# Altium schematic sheet LDO.SchDoc
size A; SheetNumber: 2; SheetTotal: 6
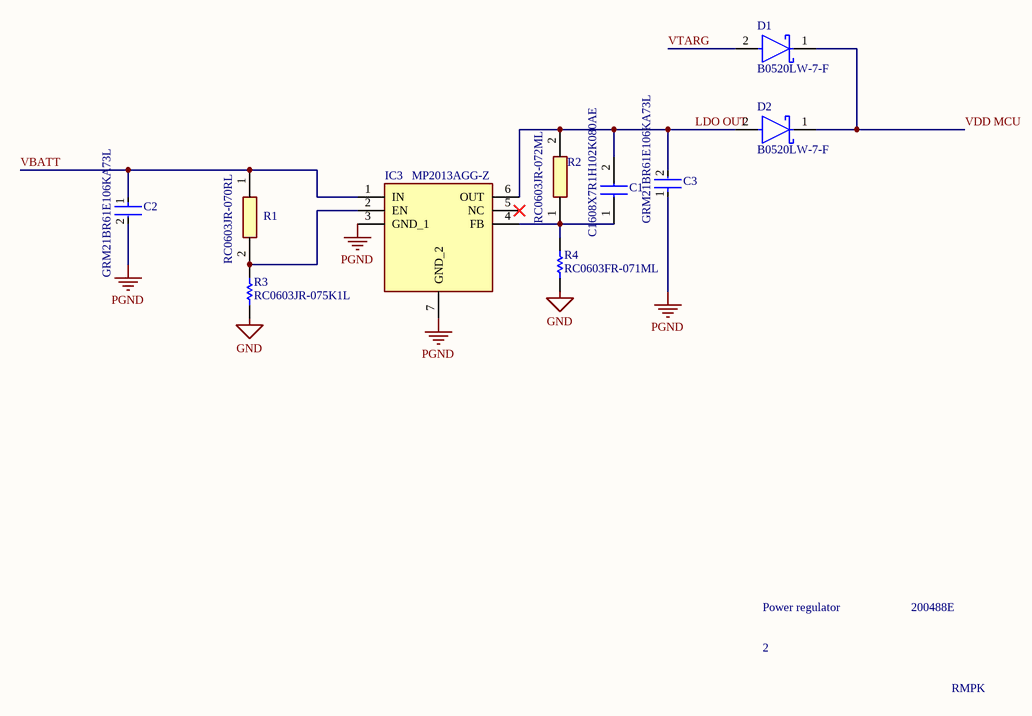
[diagram p0: LDO.SchDoc]

## Parts
C1  C1608X7R1H102K080AE  [CAPC1608X80N]
C2  GRM21BR61E106KA73L  [FP-GRM21B-0_15-IPC_C]
C3  GRM21BR61E106KA73L  [FP-GRM21B-0_15-IPC_C]
D1  B0520LW-7-F  [FP-SOD123-MFG]
D2  B0520LW-7-F  [FP-SOD123-MFG]
IC3  MP2013AGG-Z  [SON65P200X200X100-7N-D]
R1  RC0603JR-070RL  [RESC1608X55N]
R2  RC0603JR-072ML  [RESC1608X55N]
R3  RC0603JR-075K1L  [RESC1608X55X25LL10T15]
R4  RC0603FR-071ML  [RESC1608X55X25LL10T15]

## Nets
GND: R3.1 R4.1
PGND: C2.2 C3.1 IC3.3(GND_1) IC3.7(GND_2)
LDO OUT: C1.2 C3.2 D2.2(A) IC3.6(OUT) R2.2
VBATT: C2.1 IC3.1(IN) R1.1
VDD MCU: D1.1(C) D2.1(C)
VTARG: D1.2(A)
NetC1_1: C1.1 IC3.4(FB) R2.1 R4.2
NetIC3_2: IC3.2(EN) R1.2 R3.2

Not connected (* = marked no-connect by the designer): IC3 5(NC)*

## Notes on the sheet
- Power regulator
- 200488E
- 2
- RMPK

## Library data of the parts
C1 = C1608X7R1H102K080AE: Capacitor; Manufacturer_Name: TDK; Datasheet Link: https://product.tdk.com/info/en/catalog/datasheets/mlcc_commercial_midvoltage_en.pdf; Height: 0.8mm; Manufacturer_Part_Number: C1608X7R1H102K080AE; Mouser Part Number: 810-C1608X7R1H102KAE; Mouser Price/Stock: https://www.mouser.co.uk/ProductDetail/TDK/C1608X7R1H102K080AE?qs=n%2FVzw7c4a0k2XAaPZBtj3A%3D%3D; Arrow Part Number: C1608X7R1H102K080AE; Arrow Price/Stock: https://www.arrow.com/en/products/c1608x7r1h102k080ae/tdk
C2 C3 = CMP-2007-03541-2: Chip Multilayer Ceramic Capacitors for General Purpose, 0805, 10uF, X5R, 15%, 10%, 25V; Length: 2mm; Depth: 1.25mm; Termination: SMD/SMT; Voltage: 25V; Height: 1.25mm; Material: Ceramic; Thickness: 0.053inch; Radiation Hardening: No; Min Operating Temperature: -55°C; Width: 0.049inch; Package Quantity: 1; Mount: Surface Mount; Dielectric: X5R; Packaging: Tape and Reel; Capacitance: 10uF; Voltage Rating (DC): 25V; Lead Free: Lead Free; Max Operating Temperature: 85°C; Case Code (Imperial): 0805; Case/Package: 0805; Tolerance: 10%; Voltage Rating: 25V; Case Code (Metric): 2012
D1 D2 = CMP-12790-000026-1: DIODE SCHOTTKY 20V 500MA SOD123; Manufacturer: Diodes Inc.; Max Junction Temp: +125°C; Value: 170pF; Max Surge Forward Current: 5.5A; Forward Current: 0.5A; Standoff Height: 0mm; Peak Reverse Current: 250uA; Octopart: https://octopart.com/b0520lw-7-f-diodes+inc.-325707; Mouser Description: Schottky Diodes & Rectifiers 20V 410mW; ComponentLink2Description: Datasheet; Ipc Land Pattern Name: SOD365155X123-2; Device Class L1: Discrete Semiconductors; Category: Diode; ComponentLink2URL: https://www.diodes.com/assets/Datasheets/ds30051.pdf; Footprint Url: https://www.diodes.com/assets/Package-Files/SOD123.pdf; Package: SOD123; Device Class L3: Schottky Diodes; Digikey Description: DIODE SCHOTTKY 20V 500MA SOD123; Temperature Range Low: -65°C; RoHS: TRUE; Max Repetitive Reverse Voltage: 20V; Lead Free: Yes; Temperature: -65°C to +125°C; Reverse Voltage: 20V; Temperature Range High: +125°C; Capacitance: 170pF; Device Class L2: Diodes; Automotive: No; Height: 1.45mm; Manufacturer Part Number: B0520LW-7-F
IC3 = MP2013AGG-Z: Integrated Circuit; Manufacturer_Name: Monolithic Power Systems (MPS); Datasheet Link: https://www.monolithicpower.com/en/documentview/productdocument/index/version/2/document_type/Datasheet/lang/en/sku/MP2013A/; Height: 1mm; Manufacturer_Part_Number: MP2013AGG-Z; Mouser Part Number: 946-MP2013AGG-Z; Mouser Price/Stock: https://www.mouser.co.uk/ProductDetail/Monolithic-Power-Systems-MPS/MP2013AGG-Z?qs=cslStgdnz9N9a41kZxTVVA%3D%3D
R1 = RC0603JR-070RL: Resistor; Manufacturer_Name: YAGEO; Datasheet Link: https://componentsearchengine.com/Datasheets/2/RC0603JR-070RL.pdf; Height: 0.55mm; Manufacturer_Part_Number: RC0603JR-070RL; Mouser Part Number: 603-RC0603JR-070RL; Mouser Price/Stock: https://www.mouser.co.uk/ProductDetail/YAGEO/RC0603JR-070RL?qs=2cAdsCoAWRGWyPcuXgGiXQ%3D%3D; Arrow Part Number: RC0603JR-070RL; Arrow Price/Stock: https://www.arrow.com/en/products/rc0603jr-070rl/yageo?region=europe
R2 = RC0603JR-072ML: Resistor; Manufacturer_Name: YAGEO; Datasheet Link: https://www.mouser.com/datasheet/2/447/PYu_RC_Group_51_RoHS_L_11-1984063.pdf; Height: 0.55mm; Manufacturer_Part_Number: RC0603JR-072ML
R3 = CMP-1012-00091-2: Chip Resistor, 5.1 KOhm, +/- 5%, 0.1 W, -55 to 155 degC, 0603 (1608 Metric), RoHS, Tape and Reel; Manufacturer: Yageo; Resistance: 5.1kOhms; Voltage Rating: 50V; Temperature Coefficient: 100PPM/C; Power Rating: 100mW; Mounting Technology: SurfaceMount; Case Code - in: 0603; Product: ThickFilmResistorsGeneralPurpose; Series: RC; Packaging: Reel; Tolerance: 5%; Operating Temperature Range: -55Cto+155C; Package Description: 2-Pin Surface Mount Device, Body 1.6 x 0.8 mm; Manufacturer URL: http://www.yageo.com/; Datasheet Version: Rev. 7, 05/2017; Termination Style: SMD/SMT; Package Reference: 0603; Datasheet URL: http://www.yageo.com/documents/recent/PYu-RC_Group_51_RoHS_L_7.pdf; Case Code - mm: 1608
R4 = CMP-1659-00056-1: Chip Resistor, 1 MOhm, +/- 1%, 100 mW, -55 to 155 degC, 0603 (1608 Metric), RoHS, Tape and Reel; Voltage Rating (DC): 25 V; Tolerance: 20%; Case\Package: Radial; Capacitance: 1 mF; Min Operating Temperature: -40 degC; PackageDescription: 2-Pin Surface Mount Device, Body 1.6 x 0.8 mm; ComponentLink1Description: Manufacturer URL; Radiation Hardening: No; DatasheetVersion: Rev. 4, 02/2016; REACH SVHC: No SVHC; Length: 20 mm; Max Operating Temperature: 85 degC; Diameter: 10 mm; Packaging: Bulk; Package Quantity: 200; PackageReference: 0603; Mount: Through Hole; ComponentLink1URL: http://www.yageo.com/; ComponentLink2URL: http://www.yageo.com/documents/recent/PYu-RC_Group_51_RoHS_L_04.pdf; ComponentLink2Description: Datasheet; Width: 0 inch; Lead Pitch: 5 mm; RoHSCompliant: true; Voltage Rating: 25 V; Height: 20 mm